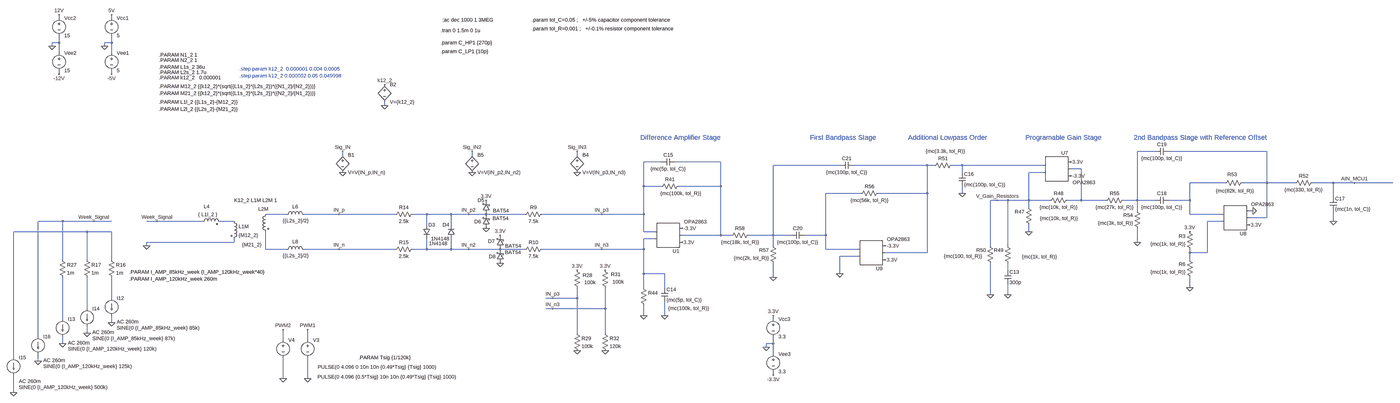
[diagram p0: schematic AFE_Simulation_with_weakest_input_signal.asc, whole sheet]
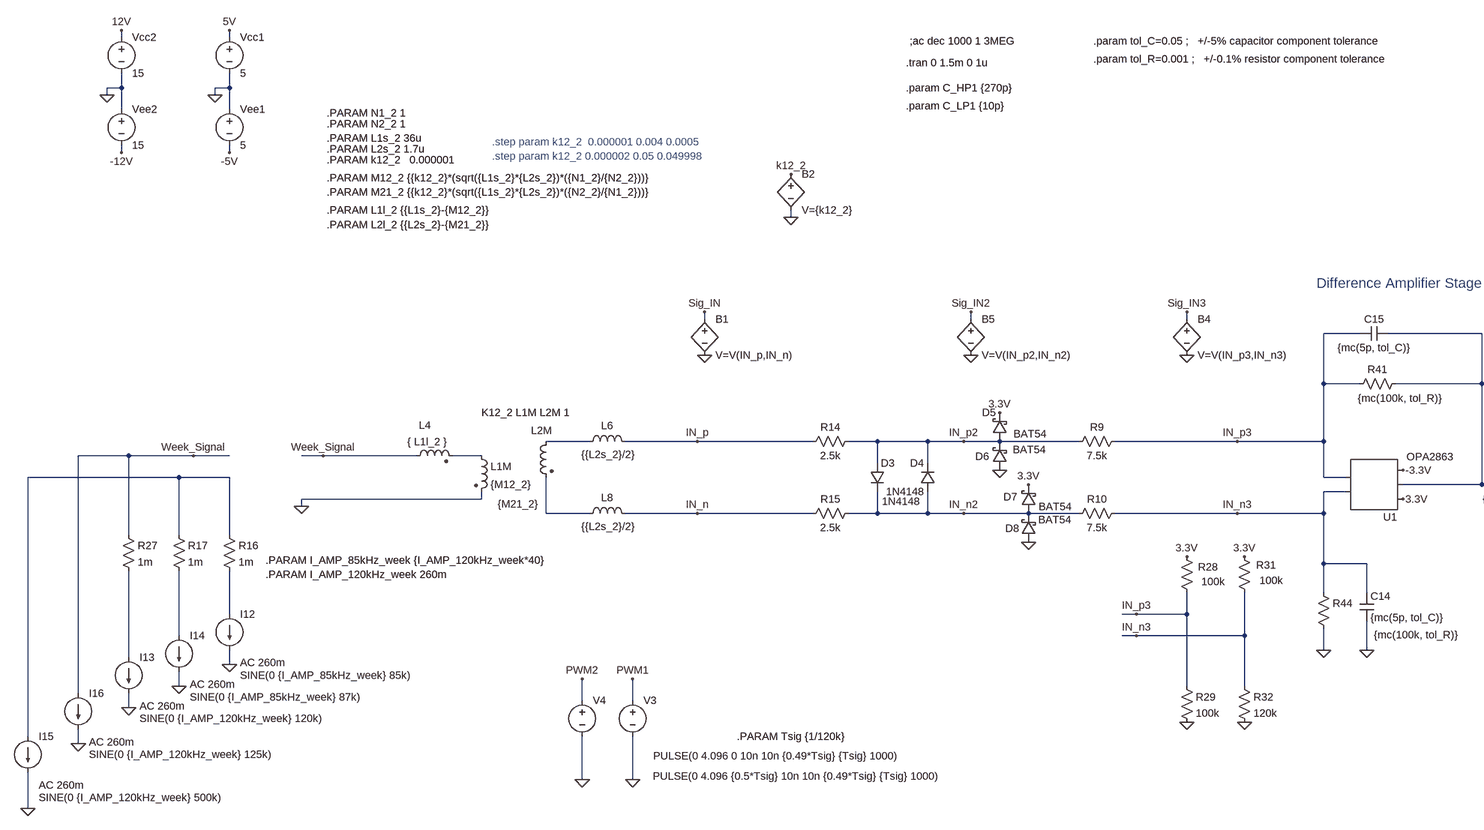
[diagram p1: schematic AFE_Simulation_with_weakest_input_signal.asc, part, row 1 of 1, column 1 of 2]
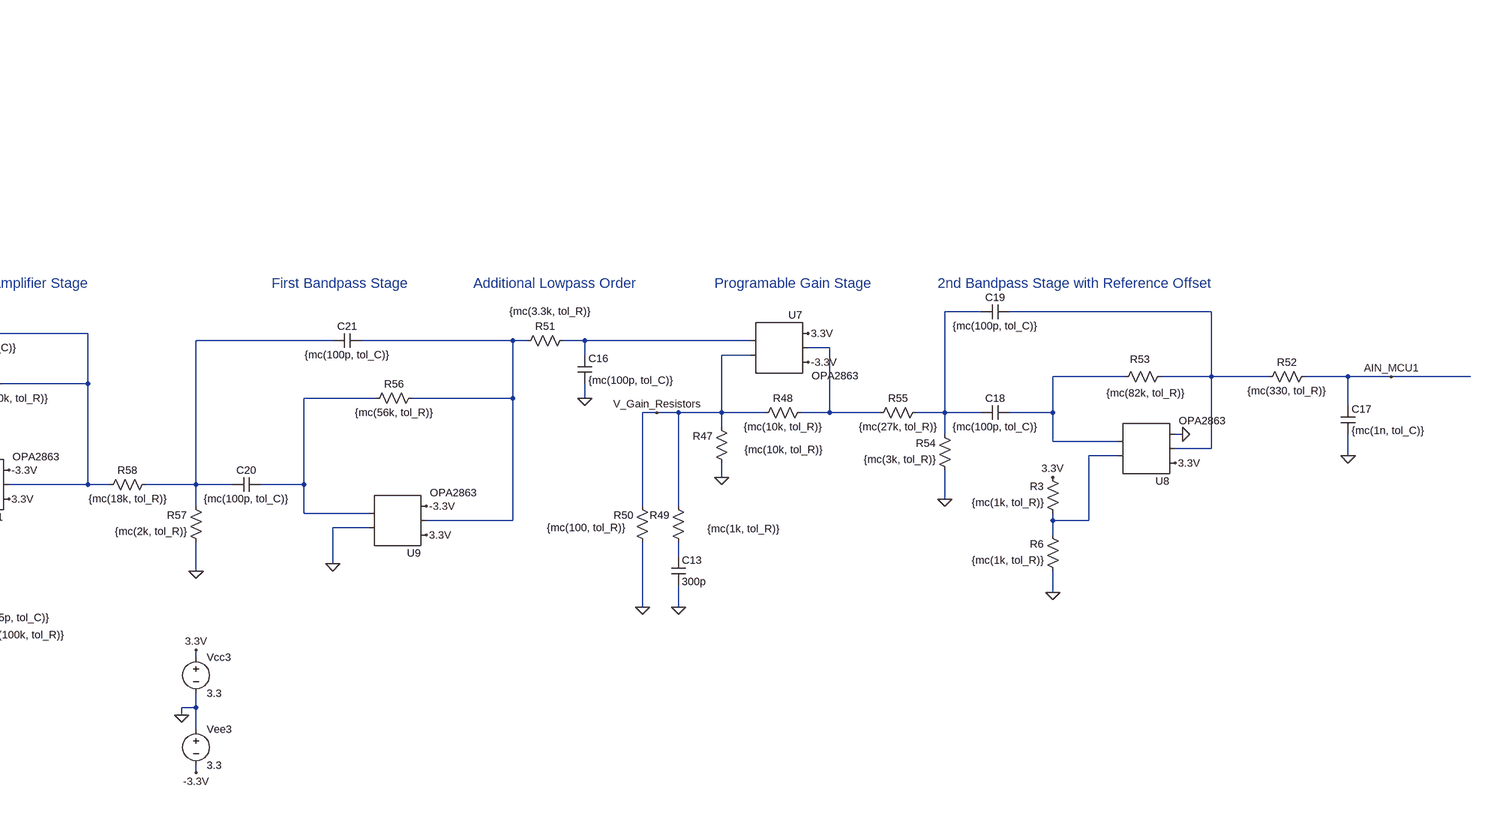
[diagram p2: schematic AFE_Simulation_with_weakest_input_signal.asc, part, row 1 of 1, column 2 of 2]
AFE_Simulation_with_weakest_input_signal.asc, the LTspice schematic file:
Version 4
SHEET 1 5200 8804
WIRE -2928 4624 -2928 4608
WIRE -2688 4624 -2688 4608
WIRE -2928 4736 -2928 4704
WIRE -2928 4736 -2960 4736
WIRE -2688 4736 -2688 4704
WIRE -2688 4736 -2720 4736
WIRE -2960 4752 -2960 4736
WIRE -2720 4752 -2720 4736
WIRE -2928 4784 -2928 4736
WIRE -2688 4784 -2688 4736
WIRE -2928 4880 -2928 4864
WIRE -2688 4880 -2688 4864
WIRE -1440 5024 -1440 5008
WIRE 2080 5344 2000 5344
WIRE 2592 5344 2144 5344
WIRE -1632 5360 -1632 5344
WIRE -1040 5360 -1040 5344
WIRE -560 5360 -560 5344
WIRE -176 5392 -256 5392
WIRE 96 5392 -112 5392
WIRE 640 5408 336 5408
WIRE 1040 5408 704 5408
WIRE 1072 5408 1040 5408
WIRE 1200 5408 1152 5408
WIRE 1568 5408 1200 5408
WIRE 1744 5424 1696 5424
WIRE 1200 5440 1200 5408
WIRE 1568 5440 1504 5440
WIRE 2400 5488 2240 5488
WIRE 2592 5488 2592 5344
WIRE 2592 5488 2480 5488
WIRE 2720 5488 2592 5488
WIRE 2896 5488 2800 5488
WIRE 2992 5488 2896 5488
WIRE 3200 5488 2992 5488
WIRE -256 5504 -256 5392
WIRE -176 5504 -256 5504
WIRE 96 5504 96 5392
WIRE 96 5504 -96 5504
WIRE 736 5536 576 5536
WIRE 1040 5536 1040 5408
WIRE 1040 5536 816 5536
WIRE 1200 5536 1200 5504
WIRE 2896 5552 2896 5488
WIRE 1360 5568 1328 5568
WIRE 1408 5568 1360 5568
WIRE 1504 5568 1504 5440
WIRE 1504 5568 1408 5568
WIRE 1600 5568 1504 5568
WIRE 1744 5568 1744 5424
WIRE 1744 5568 1680 5568
WIRE 1856 5568 1744 5568
WIRE 2000 5568 2000 5344
WIRE 2000 5568 1936 5568
WIRE 2080 5568 2000 5568
WIRE 2240 5568 2240 5488
WIRE 2240 5568 2144 5568
WIRE 1504 5600 1504 5568
WIRE 2000 5616 2000 5568
WIRE 2528 5616 2512 5616
WIRE -1888 5632 -1984 5632
WIRE -1648 5632 -1808 5632
WIRE -1392 5632 -1648 5632
WIRE -1248 5632 -1312 5632
WIRE -1136 5632 -1248 5632
WIRE -1056 5632 -1136 5632
WIRE -976 5632 -1056 5632
WIRE -800 5632 -976 5632
WIRE -448 5632 -720 5632
WIRE -256 5632 -256 5504
WIRE -256 5632 -448 5632
WIRE 2240 5632 2240 5568
WIRE 2384 5632 2240 5632
WIRE 2592 5648 2592 5488
WIRE 2592 5648 2512 5648
WIRE -2912 5664 -3024 5664
WIRE -2768 5664 -2912 5664
WIRE -2688 5664 -2768 5664
WIRE -2480 5664 -2528 5664
WIRE -2272 5664 -2480 5664
WIRE -2128 5664 -2192 5664
WIRE 2384 5664 2320 5664
WIRE 2896 5664 2896 5616
WIRE -1248 5680 -1248 5632
WIRE -1136 5680 -1136 5632
WIRE -2800 5712 -3136 5712
WIRE -2688 5712 -2800 5712
WIRE -256 5712 -256 5632
WIRE -208 5712 -256 5712
WIRE 1504 5712 1504 5680
WIRE 96 5728 96 5504
WIRE 96 5728 -80 5728
WIRE 144 5728 96 5728
WIRE 336 5728 336 5408
WIRE 336 5728 224 5728
WIRE 416 5728 336 5728
WIRE 576 5728 576 5536
WIRE 576 5728 480 5728
WIRE -208 5744 -256 5744
WIRE -2128 5760 -2128 5744
WIRE -2128 5760 -2528 5760
WIRE 2000 5760 2000 5696
WIRE -2528 5776 -2528 5760
WIRE 336 5776 336 5728
WIRE 1328 5776 1328 5568
WIRE 1408 5776 1408 5568
WIRE -1984 5792 -1984 5712
WIRE -1888 5792 -1984 5792
WIRE -1648 5792 -1808 5792
WIRE -1392 5792 -1648 5792
WIRE -1248 5792 -1248 5744
WIRE -1248 5792 -1312 5792
WIRE -1136 5792 -1136 5744
WIRE -1136 5792 -1248 5792
WIRE -1056 5792 -1136 5792
WIRE -912 5792 -1056 5792
WIRE -800 5792 -912 5792
WIRE -448 5792 -720 5792
WIRE -256 5792 -256 5744
WIRE -256 5792 -448 5792
WIRE 576 5792 576 5728
WIRE 720 5792 576 5792
WIRE 1040 5808 1040 5536
WIRE 1040 5808 848 5808
WIRE 2240 5808 2240 5792
WIRE 2320 5808 2320 5664
WIRE 2320 5808 2240 5808
WIRE 720 5824 640 5824
WIRE -2912 5840 -2912 5664
WIRE -2800 5840 -2800 5712
WIRE -2688 5840 -2688 5712
WIRE 2240 5840 2240 5808
WIRE 1408 5888 1408 5856
WIRE -256 5904 -256 5792
WIRE -160 5904 -256 5904
WIRE 640 5904 640 5824
WIRE 336 5920 336 5856
WIRE -256 5968 -256 5904
WIRE -160 5968 -160 5904
WIRE 2240 5968 2240 5920
WIRE 1328 6000 1328 5856
WIRE 1408 6000 1408 5952
WIRE -2688 6016 -2688 5920
WIRE -672 6016 -704 6016
WIRE -560 6016 -560 5968
WIRE -560 6016 -672 6016
WIRE -2800 6064 -2800 5920
WIRE -672 6064 -704 6064
WIRE -432 6064 -432 5968
WIRE -432 6064 -672 6064
WIRE -256 6096 -256 6048
WIRE -160 6096 -160 6032
WIRE -2912 6112 -2912 5920
WIRE 336 6112 336 6096
WIRE -2688 6128 -2688 6096
WIRE -2800 6176 -2800 6144
WIRE -560 6176 -560 6016
WIRE -432 6176 -432 6064
WIRE -3024 6192 -3024 5664
WIRE -1904 6208 -1904 6160
WIRE -1792 6208 -1792 6160
WIRE -2912 6224 -2912 6192
WIRE 336 6224 336 6192
WIRE 336 6224 304 6224
WIRE 304 6240 304 6224
WIRE 336 6272 336 6224
WIRE -3136 6288 -3136 5712
WIRE -3024 6304 -3024 6272
WIRE 336 6368 336 6352
WIRE -1904 6384 -1904 6288
WIRE -1792 6384 -1792 6288
WIRE -3136 6448 -3136 6368
FLAG -2928 4608 12V
FLAG -2928 4880 -12V
FLAG -2960 4752 0
FLAG -2688 4608 5V
FLAG -2688 4880 -5V
FLAG -2720 4752 0
FLAG -1440 4928 k12_2
FLAG -1440 5024 0
FLAG -80 5696 -3.3V
FLAG -256 6096 0
FLAG 1504 5712 0
FLAG 1696 5456 -3.3V
FLAG 1408 6000 0
FLAG -160 6096 0
FLAG 1200 5536 0
FLAG 2896 5664 0
FLAG 2992 5488 AIN_MCU1
FLAG 2000 5760 0
FLAG 336 5920 0
FLAG 848 5776 -3.3V
FLAG 640 5904 0
FLAG 336 6096 3.3V
FLAG 336 6368 -3.3V
FLAG 304 6240 0
FLAG -80 5760 3.3V
FLAG 848 5840 3.3V
FLAG 1696 5392 3.3V
FLAG 2512 5680 3.3V
FLAG 2528 5616 0
FLAG 2240 5968 0
FLAG 2240 5712 3.3V
FLAG 1360 5568 V_Gain_Resistors
FLAG 1328 6000 0
FLAG -2528 5776 0
FLAG -1792 6160 PWM1
FLAG -1792 6384 0
FLAG -1904 6160 PWM2
FLAG -1904 6384 0
FLAG -1632 5440 0
FLAG -1632 5344 Sig_IN
FLAG -2688 6128 0
FLAG -2800 6176 0
FLAG -2912 6224 0
FLAG -2768 5664 Week_Signal
FLAG -2480 5664 Week_Signal
FLAG -448 5632 IN_p3
FLAG -448 5792 IN_n3
FLAG -560 5888 3.3V
FLAG -432 5888 3.3V
FLAG -560 6256 0
FLAG -432 6256 0
FLAG -3136 6448 0
FLAG -3024 6304 0
FLAG -560 5440 0
FLAG -560 5344 Sig_IN3
FLAG -1040 5440 0
FLAG -1040 5344 Sig_IN2
FLAG -1056 5632 IN_p2
FLAG -1056 5792 IN_n2
FLAG -976 5696 0
FLAG -976 5568 3.3V
FLAG -912 5856 0
FLAG -912 5728 3.3V
FLAG -672 6016 IN_p3
FLAG -672 6064 IN_n3
FLAG -1648 5632 IN_p
FLAG -1648 5792 IN_n
SYMBOL voltage -2928 4768 R0
WINDOW 123 0 0 Left 2
SYMATTR InstName Vee2
SYMATTR Value 15
SYMBOL voltage -2928 4608 R0
WINDOW 123 0 0 Left 2
SYMATTR InstName Vcc2
SYMATTR Value 15
SYMBOL voltage -2688 4768 R0
WINDOW 123 0 0 Left 2
SYMATTR InstName Vee1
SYMATTR Value 5
SYMBOL voltage -2688 4608 R0
WINDOW 123 0 0 Left 2
SYMATTR InstName Vcc1
SYMATTR Value 5
SYMBOL bv -1440 4912 R0
SYMATTR InstName B2
SYMATTR Value V={k12_2}
SYMBOL res -192 5520 R270
WINDOW 0 32 56 VTop 2
WINDOW 3 -1 106 VBottom 2
SYMATTR InstName R41
SYMATTR Value {mc(100k, tol_R)}
SYMBOL res -272 5952 R0
WINDOW 3 128 110 Left 2
SYMATTR Value {mc(100k, tol_R)}
SYMATTR InstName R44
SYMBOL AutoGenerated\\OPA2863 1632 5424 R0
WINDOW 0 36 -57 Bottom 2
SYMATTR InstName U7
SYMBOL res 1520 5696 R180
WINDOW 0 36 76 Left 2
WINDOW 3 -209 46 Left 2
SYMATTR InstName R47
SYMATTR Value {mc(10k, tol_R)}
SYMBOL res 1584 5584 R270
WINDOW 0 32 56 VTop 2
WINDOW 3 0 56 VBottom 2
SYMATTR InstName R48
SYMATTR Value {mc(10k, tol_R)}
SYMBOL res 1424 5872 R180
WINDOW 0 36 76 Left 2
WINDOW 3 -209 46 Left 2
SYMATTR InstName R49
SYMATTR Value {mc(1k, tol_R)}
SYMBOL res 1344 5872 R180
WINDOW 0 36 76 Left 2
WINDOW 3 53 48 Left 2
SYMATTR InstName R50
SYMATTR Value {mc(100, tol_R)}
SYMBOL cap 1392 5888 R0
SYMATTR InstName C13
SYMATTR Value 300p
SYMBOL cap -176 5968 R0
SYMATTR InstName C14
SYMATTR Value {mc(5p, tol_C)}
SYMBOL cap -112 5376 R90
WINDOW 0 0 32 VBottom 2
WINDOW 3 32 32 VTop 2
SYMATTR InstName C15
SYMATTR Value {mc(5p, tol_C)}
SYMBOL res 1168 5392 R90
WINDOW 0 0 56 VBottom 2
WINDOW 3 -65 45 VTop 2
SYMATTR InstName R51
SYMATTR Value {mc(3.3k, tol_R)}
SYMBOL cap 1184 5440 R0
SYMATTR InstName C16
SYMATTR Value {mc(100p, tol_C)}
SYMBOL res 2816 5472 R90
WINDOW 0 0 56 VBottom 2
WINDOW 3 32 56 VTop 2
SYMATTR InstName R52
SYMATTR Value {mc(330, tol_R)}
SYMBOL cap 2880 5552 R0
SYMATTR InstName C17
SYMATTR Value {mc(1n, tol_C)}
SYMBOL AutoGenerated\\OPA2863 2448 5648 M180
WINDOW 0 36 -57 Bottom 2
SYMATTR InstName U8
SYMBOL cap 2080 5584 R270
WINDOW 0 32 32 VTop 2
WINDOW 3 0 32 VBottom 2
SYMATTR InstName C18
SYMATTR Value {mc(100p, tol_C)}
SYMBOL cap 2144 5328 R90
WINDOW 0 0 32 VBottom 2
WINDOW 3 32 32 VTop 2
SYMATTR InstName C19
SYMATTR Value {mc(100p, tol_C)}
SYMBOL res 2496 5472 R90
WINDOW 0 -7 62 VBottom 2
WINDOW 3 37 50 VTop 2
SYMATTR InstName R53
SYMATTR Value {mc(82k, tol_R)}
SYMBOL res 2016 5712 R180
WINDOW 0 36 76 Left 2
WINDOW 3 36 40 Left 2
SYMATTR InstName R54
SYMATTR Value {mc(3k, tol_R)}
SYMBOL res 1952 5552 R90
WINDOW 0 0 56 VBottom 2
WINDOW 3 32 56 VTop 2
SYMATTR InstName R55
SYMATTR Value {mc(27k, tol_R)}
SYMBOL AutoGenerated\\OPA2863 784 5808 M180
WINDOW 0 36 -57 Bottom 2
SYMATTR InstName U9
SYMBOL cap 416 5744 R270
WINDOW 0 32 32 VTop 2
WINDOW 3 0 32 VBottom 2
SYMATTR InstName C20
SYMATTR Value {mc(100p, tol_C)}
SYMBOL cap 704 5392 R90
WINDOW 0 0 32 VBottom 2
WINDOW 3 32 32 VTop 2
SYMATTR InstName C21
SYMATTR Value {mc(100p, tol_C)}
SYMBOL res 832 5520 R90
WINDOW 0 0 56 VBottom 2
WINDOW 3 32 56 VTop 2
SYMATTR InstName R56
SYMATTR Value {mc(56k, tol_R)}
SYMBOL res 352 5872 R180
WINDOW 0 36 76 Left 2
WINDOW 3 36 40 Left 2
SYMATTR InstName R57
SYMATTR Value {mc(2k, tol_R)}
SYMBOL res 240 5712 R90
WINDOW 0 0 56 VBottom 2
WINDOW 3 32 56 VTop 2
SYMATTR InstName R58
SYMATTR Value {mc(18k, tol_R)}
SYMBOL AutoGenerated\\OPA2863 -144 5728 M180
WINDOW 0 36 -57 Bottom 2
SYMATTR InstName U1
SYMBOL voltage 336 6256 R0
WINDOW 123 0 0 Left 2
SYMATTR InstName Vee3
SYMATTR Value 3.3
SYMBOL voltage 336 6096 R0
WINDOW 123 0 0 Left 2
SYMATTR InstName Vcc3
SYMATTR Value 3.3
SYMBOL res 2256 5808 R180
WINDOW 0 36 76 Left 2
WINDOW 3 36 40 Left 2
SYMATTR InstName R3
SYMATTR Value {mc(1k, tol_R)}
SYMBOL res 2256 5936 R180
WINDOW 0 36 76 Left 2
WINDOW 3 36 40 Left 2
SYMATTR InstName R6
SYMATTR Value {mc(1k, tol_R)}
SYMBOL ind2 -2288 5680 R270
WINDOW 0 68 35 VTop 2
WINDOW 3 63 40 VBottom 2
SYMATTR InstName L4
SYMATTR Value { L1l_2 }
SYMATTR Type ind
SYMATTR SpiceLine Rpar=1MEG
SYMBOL ind2 -1968 5616 M0
WINDOW 3 33 155 Left 2
WINDOW 0 2 -8 Left 2
SYMATTR Value {M21_2}
SYMATTR InstName L2M
SYMATTR Type ind
SYMATTR SpiceLine Rser=5 Rpar=1MEG
SYMBOL ind -1904 5648 R270
WINDOW 0 35 56 VTop 2
WINDOW 3 2 58 VBottom 2
SYMATTR InstName L6
SYMATTR Value {{L2s_2}/2}
SYMATTR SpiceLine Rpar=1MegR
SYMBOL ind2 -2144 5648 R0
SYMATTR InstName L1M
SYMATTR Value {M12_2}
SYMATTR Type ind
SYMATTR SpiceLine Rser=100m Rpar=1MEG
SYMBOL ind -1904 5808 R270
WINDOW 0 35 56 VTop 2
WINDOW 3 2 58 VBottom 2
SYMATTR InstName L8
SYMATTR Value {{L2s_2}/2}
SYMATTR SpiceLine Rpar=1MegR
SYMBOL res -704 5616 R90
WINDOW 0 0 56 VBottom 2
WINDOW 3 32 56 VTop 2
SYMATTR InstName R9
SYMATTR Value 7.5k
SYMBOL res -704 5776 R90
WINDOW 0 0 56 VBottom 2
WINDOW 3 32 56 VTop 2
SYMATTR InstName R10
SYMATTR Value 7.5k
SYMBOL diode -1264 5680 R0
WINDOW 3 26 85 Left 2
SYMATTR Value 1N4148
SYMATTR InstName D3
SYMBOL diode -1120 5744 R180
WINDOW 0 24 64 Left 2
WINDOW 3 24 0 Left 2
SYMATTR InstName D4
SYMATTR Value 1N4148
SYMBOL voltage -1792 6192 R0
WINDOW 123 0 0 Left 0
WINDOW 39 0 0 Left 0
WINDOW 3 46 139 Left 2
SYMATTR Value PULSE(0 4.096 0 10n 10n {0.49*Tsig} {Tsig} 1000)
SYMATTR InstName V3
SYMBOL voltage -1904 6192 R0
WINDOW 123 0 0 Left 0
WINDOW 39 0 0 Left 0
WINDOW 3 157 184 Left 2
SYMATTR Value PULSE(0 4.096 {0.5*Tsig} 10n 10n {0.49*Tsig} {Tsig} 1000)
SYMATTR InstName V4
SYMBOL res -1296 5616 R90
WINDOW 0 0 56 VBottom 2
WINDOW 3 32 56 VTop 2
SYMATTR InstName R14
SYMATTR Value 2.5k
SYMBOL res -1296 5776 R90
WINDOW 0 0 56 VBottom 2
WINDOW 3 32 56 VTop 2
SYMATTR InstName R15
SYMATTR Value 2.5k
SYMBOL bv -1632 5344 R0
SYMATTR InstName B1
SYMATTR Value V=V(IN_p,IN_n)
SYMBOL current -2688 6016 R0
WINDOW 3 24 136 Left 2
WINDOW 123 24 108 Left 2
WINDOW 39 0 0 Left 0
SYMATTR Value SINE(0 {I_AMP_85kHz_week} 85k)
SYMATTR Value2 AC 260m
SYMATTR InstName I12
SYMBOL current -2912 6112 R0
WINDOW 3 24 136 Left 2
WINDOW 123 24 108 Left 2
WINDOW 39 0 0 Left 0
SYMATTR Value SINE(0 {I_AMP_120kHz_week} 120k)
SYMATTR Value2 AC 260m
SYMATTR InstName I13
SYMBOL res -2704 5824 R0
SYMATTR InstName R16
SYMATTR Value 1m
SYMBOL res -2816 5824 R0
SYMATTR InstName R17
SYMATTR Value 1m
SYMBOL res -2928 5824 R0
SYMATTR InstName R27
SYMATTR Value 1m
SYMBOL current -2800 6064 R0
WINDOW 3 24 136 Left 2
WINDOW 123 24 108 Left 2
WINDOW 39 0 0 Left 0
SYMATTR Value SINE(0 {I_AMP_85kHz_week} 87k)
SYMATTR Value2 AC 260m
SYMATTR InstName I14
SYMBOL res -544 5984 R180
WINDOW 0 -53 73 Left 2
WINDOW 3 -69 40 Left 2
SYMATTR InstName R28
SYMATTR Value 100k
SYMBOL res -576 6160 R0
SYMATTR InstName R29
SYMATTR Value 100k
SYMBOL res -416 5984 R180
WINDOW 0 -54 77 Left 2
WINDOW 3 -70 43 Left 2
SYMATTR InstName R31
SYMATTR Value 100k
SYMBOL res -448 6160 R0
SYMATTR InstName R32
SYMATTR Value 120k
SYMBOL current -3136 6288 R0
WINDOW 3 24 136 Left 2
WINDOW 123 24 108 Left 2
WINDOW 39 0 0 Left 0
SYMATTR Value SINE(0 {I_AMP_120kHz_week} 500k)
SYMATTR Value2 AC 260m
SYMATTR InstName I15
SYMBOL current -3024 6192 R0
WINDOW 3 24 136 Left 2
WINDOW 123 24 108 Left 2
WINDOW 39 0 0 Left 0
SYMATTR Value SINE(0 {I_AMP_120kHz_week} 125k)
SYMATTR Value2 AC 260m
SYMATTR InstName I16
SYMBOL bv -560 5344 R0
SYMATTR InstName B4
SYMATTR Value V=V(IN_p3,IN_n3)
SYMBOL bv -1040 5344 R0
SYMATTR InstName B5
SYMATTR Value V=V(IN_p2,IN_n2)
SYMBOL schottky -960 5632 R180
WINDOW 0 24 64 Left 2
WINDOW 3 -88 17 Left 2
SYMATTR InstName D5
SYMATTR Value BAT54
SYMBOL schottky -960 5696 R180
WINDOW 0 39 31 Left 2
WINDOW 3 -87 46 Left 2
SYMATTR InstName D6
SYMATTR Value BAT54
SYMBOL schottky -896 5792 R180
WINDOW 0 41 37 Left 2
WINDOW 3 -80 15 Left 2
SYMATTR InstName D7
SYMATTR Value BAT54
SYMBOL schottky -896 5856 R180
WINDOW 0 37 31 Left 2
WINDOW 3 -79 50 Left 2
SYMATTR InstName D8
SYMATTR Value BAT54
TEXT -1184 4680 Left 2 !.tran 0 1.5m 0 1u
TEXT -1176 4632 Left 2 !;ac dec 1000 1 3MEG
TEXT -2472 4896 Left 2 !.PARAM k12_2   0.000001
TEXT -2472 4936 Left 2 !.PARAM M12_2 {{k12_2}*(sqrt({L1s_2}*{L2s_2})*({N1_2}/{N2_2}))}
TEXT -2472 4968 Left 2 !.PARAM M21_2 {{k12_2}*(sqrt({L1s_2}*{L2s_2})*({N2_2}/{N1_2}))}
TEXT -2472 4848 Left 2 !.PARAM L1s_2 36u
TEXT -2472 4872 Left 2 !.PARAM L2s_2 1.7u
TEXT -2472 4792 Left 2 !.PARAM N1_2 1
TEXT -2472 4816 Left 2 !.PARAM N2_2 1
TEXT -2472 5008 Left 2 !.PARAM L1l_2 {{L1s_2}-{M12_2}}
TEXT -2472 5040 Left 2 !.PARAM L2l_2 {{L2s_2}-{M21_2}}
TEXT -1184 4736 Left 2 !.param C_HP1 {270p}
TEXT -1184 4776 Left 2 !.param C_LP1 {10p}
TEXT -2104 4856 Left 2 ;.step param k12_2  0.000001 0.004 0.0005
TEXT -2104 4888 Left 2 ;.step param k12_2 0.000002 0.05 0.049998
TEXT -768 4632 Left 2 !.param tol_C=0.05 ;   +/-5% capacitor component tolerance
TEXT -768 4672 Left 2 !.param tol_R=0.001 ;   +/-0.1% resistor component tolerance
TEXT -272 5280 Left 3 ;Difference Amplifier Stage
TEXT 504 5280 Left 3 ;First Bandpass Stage
TEXT 952 5280 Left 3 ;Additional Lowpass Order
TEXT 1488 5280 Left 3 ;Programable Gain Stage
TEXT 1984 5280 Left 3 ;2nd Bandpass Stage with Reference Offset
TEXT -2128 5568 Left 2 !K12_2 L1M L2M 1
TEXT -1560 6288 Left 2 !.PARAM Tsig {1/120k}
TEXT -2608 5928 Left 2 !.PARAM I_AMP_120kHz_week 260m
TEXT -2608 5896 Left 2 !.PARAM I_AMP_85kHz_week {I_AMP_120kHz_week*40}

The netlist it stands for:
* AFE_Simulation_with_weakest_input_signal.asc
Vee2 0 -12V 15
Vcc2 12V 0 15
Vee1 0 -5V 5
Vcc1 5V 0 5
B2 k12_2 0 V={k12_2}
R41 IN_p3 N003 {mc(100k, tol_R)}
R44 IN_n3 0 {mc(100k, tol_R)}
* U7: OPA2863 (symbol AutoGenerated\OPA2863 not available, pins judged from their places): pin1=N006 pin2=V_Gain_Resistors pin3=3.3V pin4=N007 pin5=-3.3V
R47 0 V_Gain_Resistors {mc(10k, tol_R)}
R48 V_Gain_Resistors N007 {mc(10k, tol_R)}
R49 N015 V_Gain_Resistors {mc(1k, tol_R)}
R50 0 V_Gain_Resistors {mc(100, tol_R)}
C13 N015 0 300p
C14 IN_n3 0 {mc(5p, tol_C)}
C15 N003 IN_p3 {mc(5p, tol_C)}
R51 N006 N005 {mc(3.3k, tol_R)}
C16 N006 0 {mc(100p, tol_C)}
R52 AIN_MCU1 N002 {mc(330, tol_R)}
C17 AIN_MCU1 0 {mc(1n, tol_C)}
* U8: OPA2863 (symbol AutoGenerated\OPA2863 not available, pins judged from their places): pin1=N012 pin2=N008 pin3=3.3V pin4=N002 pin5=0
C18 N001 N008 {mc(100p, tol_C)}
C19 N002 N001 {mc(100p, tol_C)}
R53 N002 N008 {mc(82k, tol_R)}
R54 0 N001 {mc(3k, tol_R)}
R55 N001 N007 {mc(27k, tol_R)}
* U9: OPA2863 (symbol AutoGenerated\OPA2863 not available, pins judged from their places): pin1=0 pin2=N009 pin3=3.3V pin4=N005 pin5=-3.3V
C20 N004 N009 {mc(100p, tol_C)}
C21 N005 N004 {mc(100p, tol_C)}
R56 N005 N009 {mc(56k, tol_R)}
R57 0 N004 {mc(2k, tol_R)}
R58 N004 N003 {mc(18k, tol_R)}
* U1: OPA2863 (symbol AutoGenerated\OPA2863 not available, pins judged from their places): pin1=IN_n3 pin2=IN_p3 pin3=3.3V pin4=N003 pin5=-3.3V
Vee3 0 -3.3V 3.3
Vcc3 3.3V 0 3.3
R3 N012 3.3V {mc(1k, tol_R)}
R6 0 N012 {mc(1k, tol_R)}
L4 Week_Signal N011 { L1l_2 } Rpar=1MEG
L2M N010 N014 {M21_2} Rser=5 Rpar=1MEG
L6 N010 IN_p {{L2s_2}/2} Rpar=1MegR
L1M N011 0 {M12_2} Rser=100m Rpar=1MEG
L8 N014 IN_n {{L2s_2}/2} Rpar=1MegR
R9 IN_p3 IN_p2 7.5k
R10 IN_n3 IN_n2 7.5k
D3 IN_p2 IN_n2 1N4148
D4 IN_n2 IN_p2 1N4148
V3 PWM1 0 PULSE(0 4.096 0 10n 10n {0.49*Tsig} {Tsig} 1000)
V4 PWM2 0 PULSE(0 4.096 {0.5*Tsig} 10n 10n {0.49*Tsig} {Tsig} 1000)
R14 IN_p2 IN_p 2.5k
R15 IN_n2 IN_n 2.5k
B1 Sig_IN 0 V=V(IN_p,IN_n)
I12 N016 0 SINE(0 {I_AMP_85kHz_week} 85k) AC 260m
I13 N018 0 SINE(0 {I_AMP_120kHz_week} 120k) AC 260m
R16 N013 N016 1m
R17 N013 N017 1m
R27 Week_Signal N018 1m
I14 N017 0 SINE(0 {I_AMP_85kHz_week} 87k) AC 260m
R28 IN_p3 3.3V 100k
R29 IN_p3 0 100k
R31 IN_n3 3.3V 100k
R32 IN_n3 0 120k
I15 N013 0 SINE(0 {I_AMP_120kHz_week} 500k) AC 260m
I16 Week_Signal 0 SINE(0 {I_AMP_120kHz_week} 125k) AC 260m
B4 Sig_IN3 0 V=V(IN_p3,IN_n3)
B5 Sig_IN2 0 V=V(IN_p2,IN_n2)
D5 IN_p2 3.3V BAT54
D6 0 IN_p2 BAT54
D7 IN_n2 3.3V BAT54
D8 0 IN_n2 BAT54
.model D D
.lib standard.dio
.tran 0 1.5m 0 1u
;ac dec 1000 1 3MEG
.PARAM k12_2   0.000001
.PARAM M12_2 {{k12_2}*(sqrt({L1s_2}*{L2s_2})*({N1_2}/{N2_2}))}
.PARAM M21_2 {{k12_2}*(sqrt({L1s_2}*{L2s_2})*({N2_2}/{N1_2}))}
.PARAM L1s_2 36u
.PARAM L2s_2 1.7u
.PARAM N1_2 1
.PARAM N2_2 1
.PARAM L1l_2 {{L1s_2}-{M12_2}}
.PARAM L2l_2 {{L2s_2}-{M21_2}}
.param C_HP1 {270p}
.param C_LP1 {10p}
* .step param k12_2  0.000001 0.004 0.0005
* .step param k12_2 0.000002 0.05 0.049998
.param tol_C=0.05 ;   +/-5% capacitor component tolerance
.param tol_R=0.001 ;   +/-0.1% resistor component tolerance
* Difference Amplifier Stage
* First Bandpass Stage
* Additional Lowpass Order
* Programable Gain Stage
* 2nd Bandpass Stage with Reference Offset
K12_2 L1M L2M 1
.PARAM Tsig {1/120k}
.PARAM I_AMP_120kHz_week 260m
.PARAM I_AMP_85kHz_week {I_AMP_120kHz_week*40}
.backanno
.end